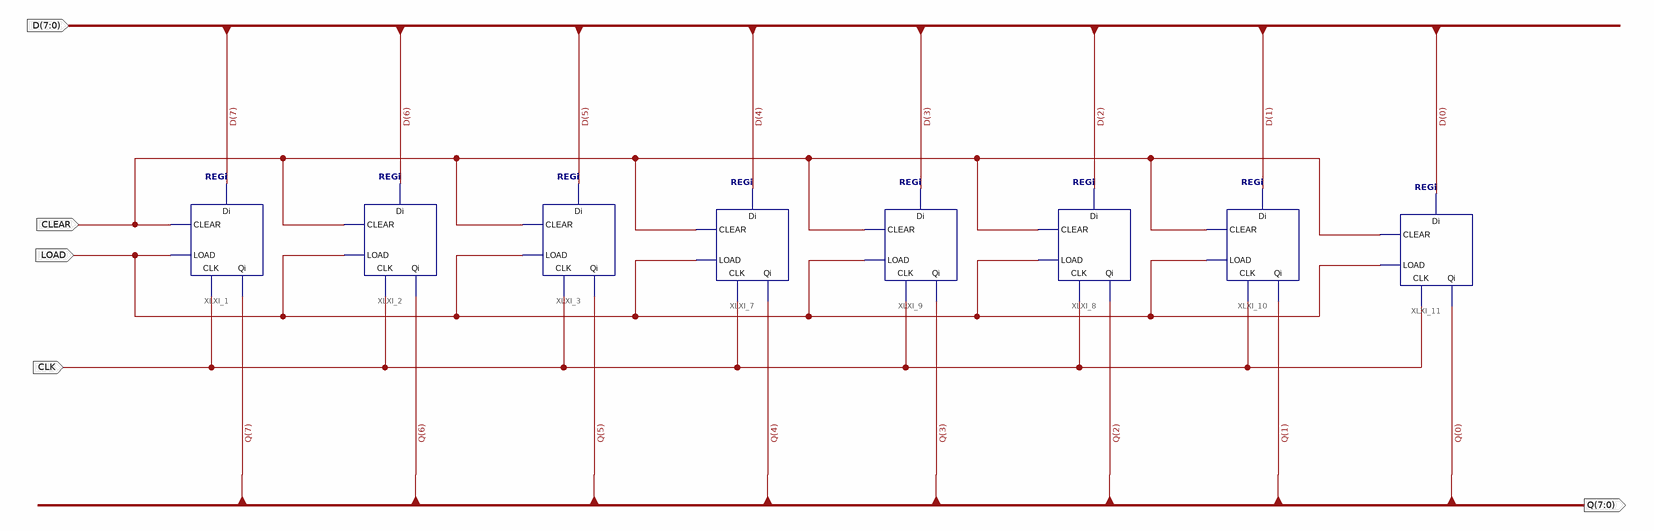
[diagram p0: schematic sheet 1]
// Xilinx ISE schematic TEMP.sch (spartan3e) as structural Verilog: 8 symbols, 5 ports
module TEMP (
  input  CLEAR,
  input  LOAD,
  input  CLK,
  input  [7:0] D,
  output [7:0] Q
);

  REGi XLXI_7 (.Di(D[4]), .Qi(Q[4]), .CLK(CLK), .LOAD(LOAD), .CLEAR(CLEAR));
  REGi XLXI_9 (.Di(D[3]), .Qi(Q[3]), .CLK(CLK), .LOAD(LOAD), .CLEAR(CLEAR));
  REGi XLXI_8 (.Di(D[2]), .Qi(Q[2]), .CLK(CLK), .LOAD(LOAD), .CLEAR(CLEAR));
  REGi XLXI_3 (.Di(D[5]), .Qi(Q[5]), .CLK(CLK), .LOAD(LOAD), .CLEAR(CLEAR));
  REGi XLXI_2 (.Di(D[6]), .Qi(Q[6]), .CLK(CLK), .LOAD(LOAD), .CLEAR(CLEAR));
  REGi XLXI_1 (.Di(D[7]), .Qi(Q[7]), .CLK(CLK), .LOAD(LOAD), .CLEAR(CLEAR));
  REGi XLXI_10 (.Di(D[1]), .Qi(Q[1]), .CLK(CLK), .LOAD(LOAD), .CLEAR(CLEAR));
  REGi XLXI_11 (.Di(D[0]), .Qi(Q[0]), .CLK(CLK), .LOAD(LOAD), .CLEAR(CLEAR));
endmodule
